# EAGLE schematic 10004_epic_cape (EAGLE 6.3)

## Sheet 1 of 3
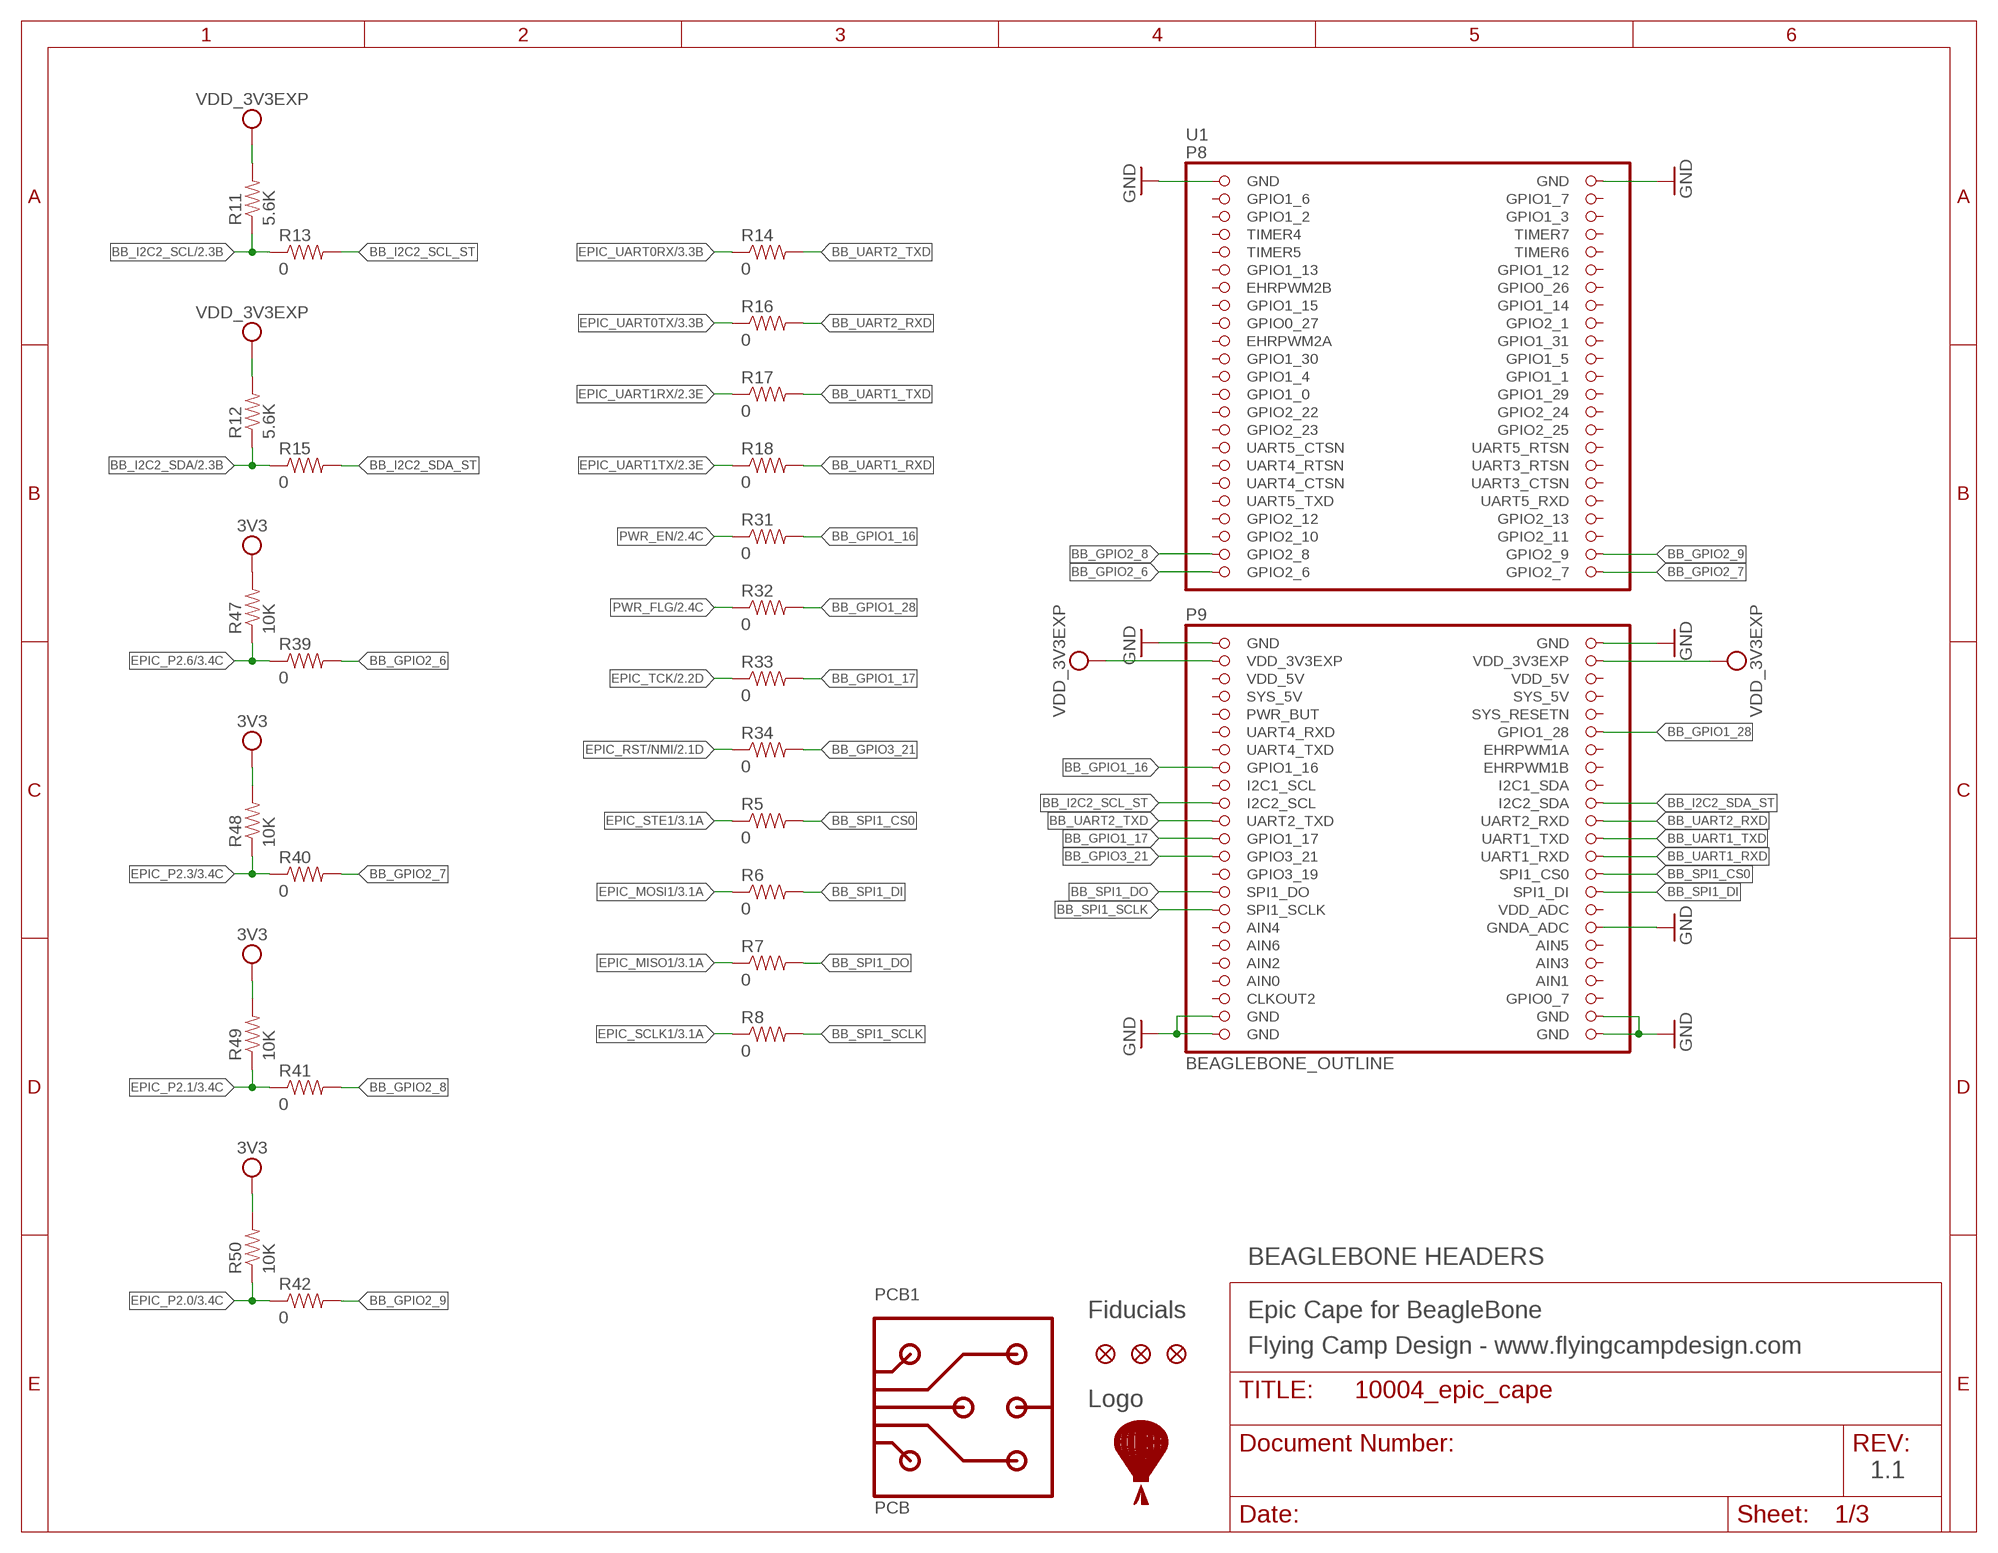
[diagram p0: schematic, sheet 1]
PCB1 (PCB): MFR: Flying Camp Design; MPN: 10004

### Parts
R5  0  RESISTOR1005  [RESC1005]
R6  0  RESISTOR1005  [RESC1005]
R7  0  RESISTOR1005  [RESC1005]
R8  0  RESISTOR1005  [RESC1005]
R11  5.6K  RESISTOR1005  [RESC1005]
R12  5.6K  RESISTOR1005  [RESC1005]
R13  0  RESISTOR1005  [RESC1005]
R14  0  RESISTOR1005  [RESC1005]
R15  0  RESISTOR1005  [RESC1005]
R16  0  RESISTOR1005  [RESC1005]
R17  0  RESISTOR1005  [RESC1005]
R18  0  RESISTOR1005  [RESC1005]
R31  0  RESISTOR1005  [RESC1005]
R32  0  RESISTOR1005  [RESC1005]
R33  0  RESISTOR1005  [RESC1005]
R34  0  RESISTOR1005  [RESC1005]
R39  0  RESISTOR1005  [RESC1005]
R40  0  RESISTOR1005  [RESC1005]
R41  0  RESISTOR1005  [RESC1005]
R42  0  RESISTOR1005  [RESC1005]
R47  10K  RESISTOR1005  [RESC1005]
R48  10K  RESISTOR1005  [RESC1005]
R49  10K  RESISTOR1005  [RESC1005]
R50  10K  RESISTOR1005  [RESC1005]
U1  BEAGLEBONE_OUTLINE  [BEAGLEBONE_SHIELD]
U$2  LOGO  [LOGO]
U$3  FIDUCIAL1X2.5  [FIDUCIAL-1X2.5]
U$4  FIDUCIAL1X2.5  [FIDUCIAL-1X2.5]
U$5  FIDUCIAL1X2.5  [FIDUCIAL-1X2.5]

### Nets
3V3: R47.2 R48.2 R49.2 R50.2 ; also sheet 2,3
BB_GPIO1_16: R31.2 U1.61(GPIO1_16)
BB_GPIO1_17: R33.2 U1.69(GPIO1_17)
BB_GPIO1_28: R32.2 U1.58(GPIO1_28)
BB_GPIO2_6: R39.2 U1.45(GPIO2_6)
BB_GPIO2_7: R40.2 U1.46(GPIO2_7)
BB_GPIO2_8: R41.2 U1.43(GPIO2_8)
BB_GPIO2_9: R42.2 U1.44(GPIO2_9)
BB_GPIO3_21: R34.2 U1.71(GPIO3_21)
BB_I2C2_SCL: R11.1 R13.1 ; also sheet 2
BB_I2C2_SCL_ST: R13.2 U1.65(I2C2_SCL)
BB_I2C2_SDA: R12.1 R15.1 ; also sheet 2
BB_I2C2_SDA_ST: R15.2 U1.66(I2C2_SDA)
BB_SPI1_CS0: R5.2 U1.74(SPI1_CS0)
BB_SPI1_DI: R6.2 U1.76(SPI1_DI)
BB_SPI1_DO: R7.2 U1.75(SPI1_DO)
BB_SPI1_SCLK: R8.2 U1.77(SPI1_SCLK)
BB_UART1_RXD: R18.2 U1.72(UART1_RXD)
BB_UART1_TXD: R17.2 U1.70(UART1_TXD)
BB_UART2_RXD: R16.2 U1.68(UART2_RXD)
BB_UART2_TXD: R14.2 U1.67(UART2_TXD)
EPIC_MISO1: R7.1 ; also sheet 3
EPIC_MOSI1: R6.1 ; also sheet 3
EPIC_P2.0: R42.1 R50.1 ; also sheet 3
EPIC_P2.1: R41.1 R49.1 ; also sheet 3
EPIC_P2.3: R40.1 R48.1 ; also sheet 3
EPIC_P2.6: R39.1 R47.1 ; also sheet 3
EPIC_RST/NMI: R34.1 ; also sheet 2,3
EPIC_SCLK1: R8.1 ; also sheet 3
EPIC_STE1: R5.1 ; also sheet 3
EPIC_TCK: R33.1 ; also sheet 2,3
EPIC_UART0RX: R14.1 ; also sheet 3
EPIC_UART0TX: R16.1 ; also sheet 3
EPIC_UART1RX: R17.1 ; also sheet 2,3
EPIC_UART1TX: R18.1 ; also sheet 2,3
GND: U1.1(GND) U1.2(GND) U1.47(GND) U1.48(GND) U1.80(GNDA_ADC) U1.89(GND) U1.90(GND) U1.91(GND) U1.92(GND) ; also sheet 2,3
PWR_EN: R31.1 ; also sheet 2
PWR_FLG: R32.1 ; also sheet 2
VDD_3V3EXP: R11.2 R12.2 U1.49(VDD_3V3EXP) U1.50(VDD_3V3EXP) ; also sheet 2
Unconnected: U1.5(GPIO1_2) U1.6(GPIO1_3) U1.7(TIMER4) U1.8(TIMER7) U1.9(TIMER5) U1.10(TIMER6) U1.11(GPIO1_13) U1.12(GPIO1_12) U1.13(EHRPWM2B) U1.14(GPIO0_26) U1.15(GPIO1_15) U1.16(GPIO1_14) U1.17(GPIO0_27) U1.18(GPIO2_1) U1.19(EHRPWM2A) U1.20(GPIO1_31) U1.21(GPIO1_30) U1.22(GPIO1_5) U1.23(GPIO1_4) U1.24(GPIO1_1) U1.25(GPIO1_0) U1.26(GPIO1_29) U1.27(GPIO2_22) U1.28(GPIO2_24) U1.29(GPIO2_23) U1.30(GPIO2_25) U1.31(UART5_CTSN) U1.32(UART5_RTSN) U1.33(UART4_RTSN) U1.34(UART3_RTSN) U1.35(UART4_CTSN) U1.36(UART3_CTSN) U1.37(UART5_TXD) U1.38(UART5_RXD) U1.39(GPIO2_12) U1.40(GPIO2_13) U1.41(GPIO2_10) U1.53(SYS_5V) U1.54(SYS_5V) U1.55(PWR_BUT) U1.56(SYS_RESETN) U1.57(UART4_RXD) U1.59(UART4_TXD) U1.60(EHRPWM1A) U1.62(EHRPWM1B) U1.63(I2C1_SCL) U1.64(I2C1_SDA) U1.73(GPIO3_19) U1.78(VDD_ADC) U1.79(AIN4) U1.81(AIN6) U1.82(AIN5) U1.83(AIN2) U1.86(AIN1) U1.87(CLKOUT2) U1.88(GPIO0_7)

### Notes on the sheet
- BEAGLEBONE HEADERS
- Fiducials | Epic Cape for BeagleBone
- Flying Camp Design - www.flyingcampdesign.com
- Logo
- 1.1

## Sheet 2 of 3
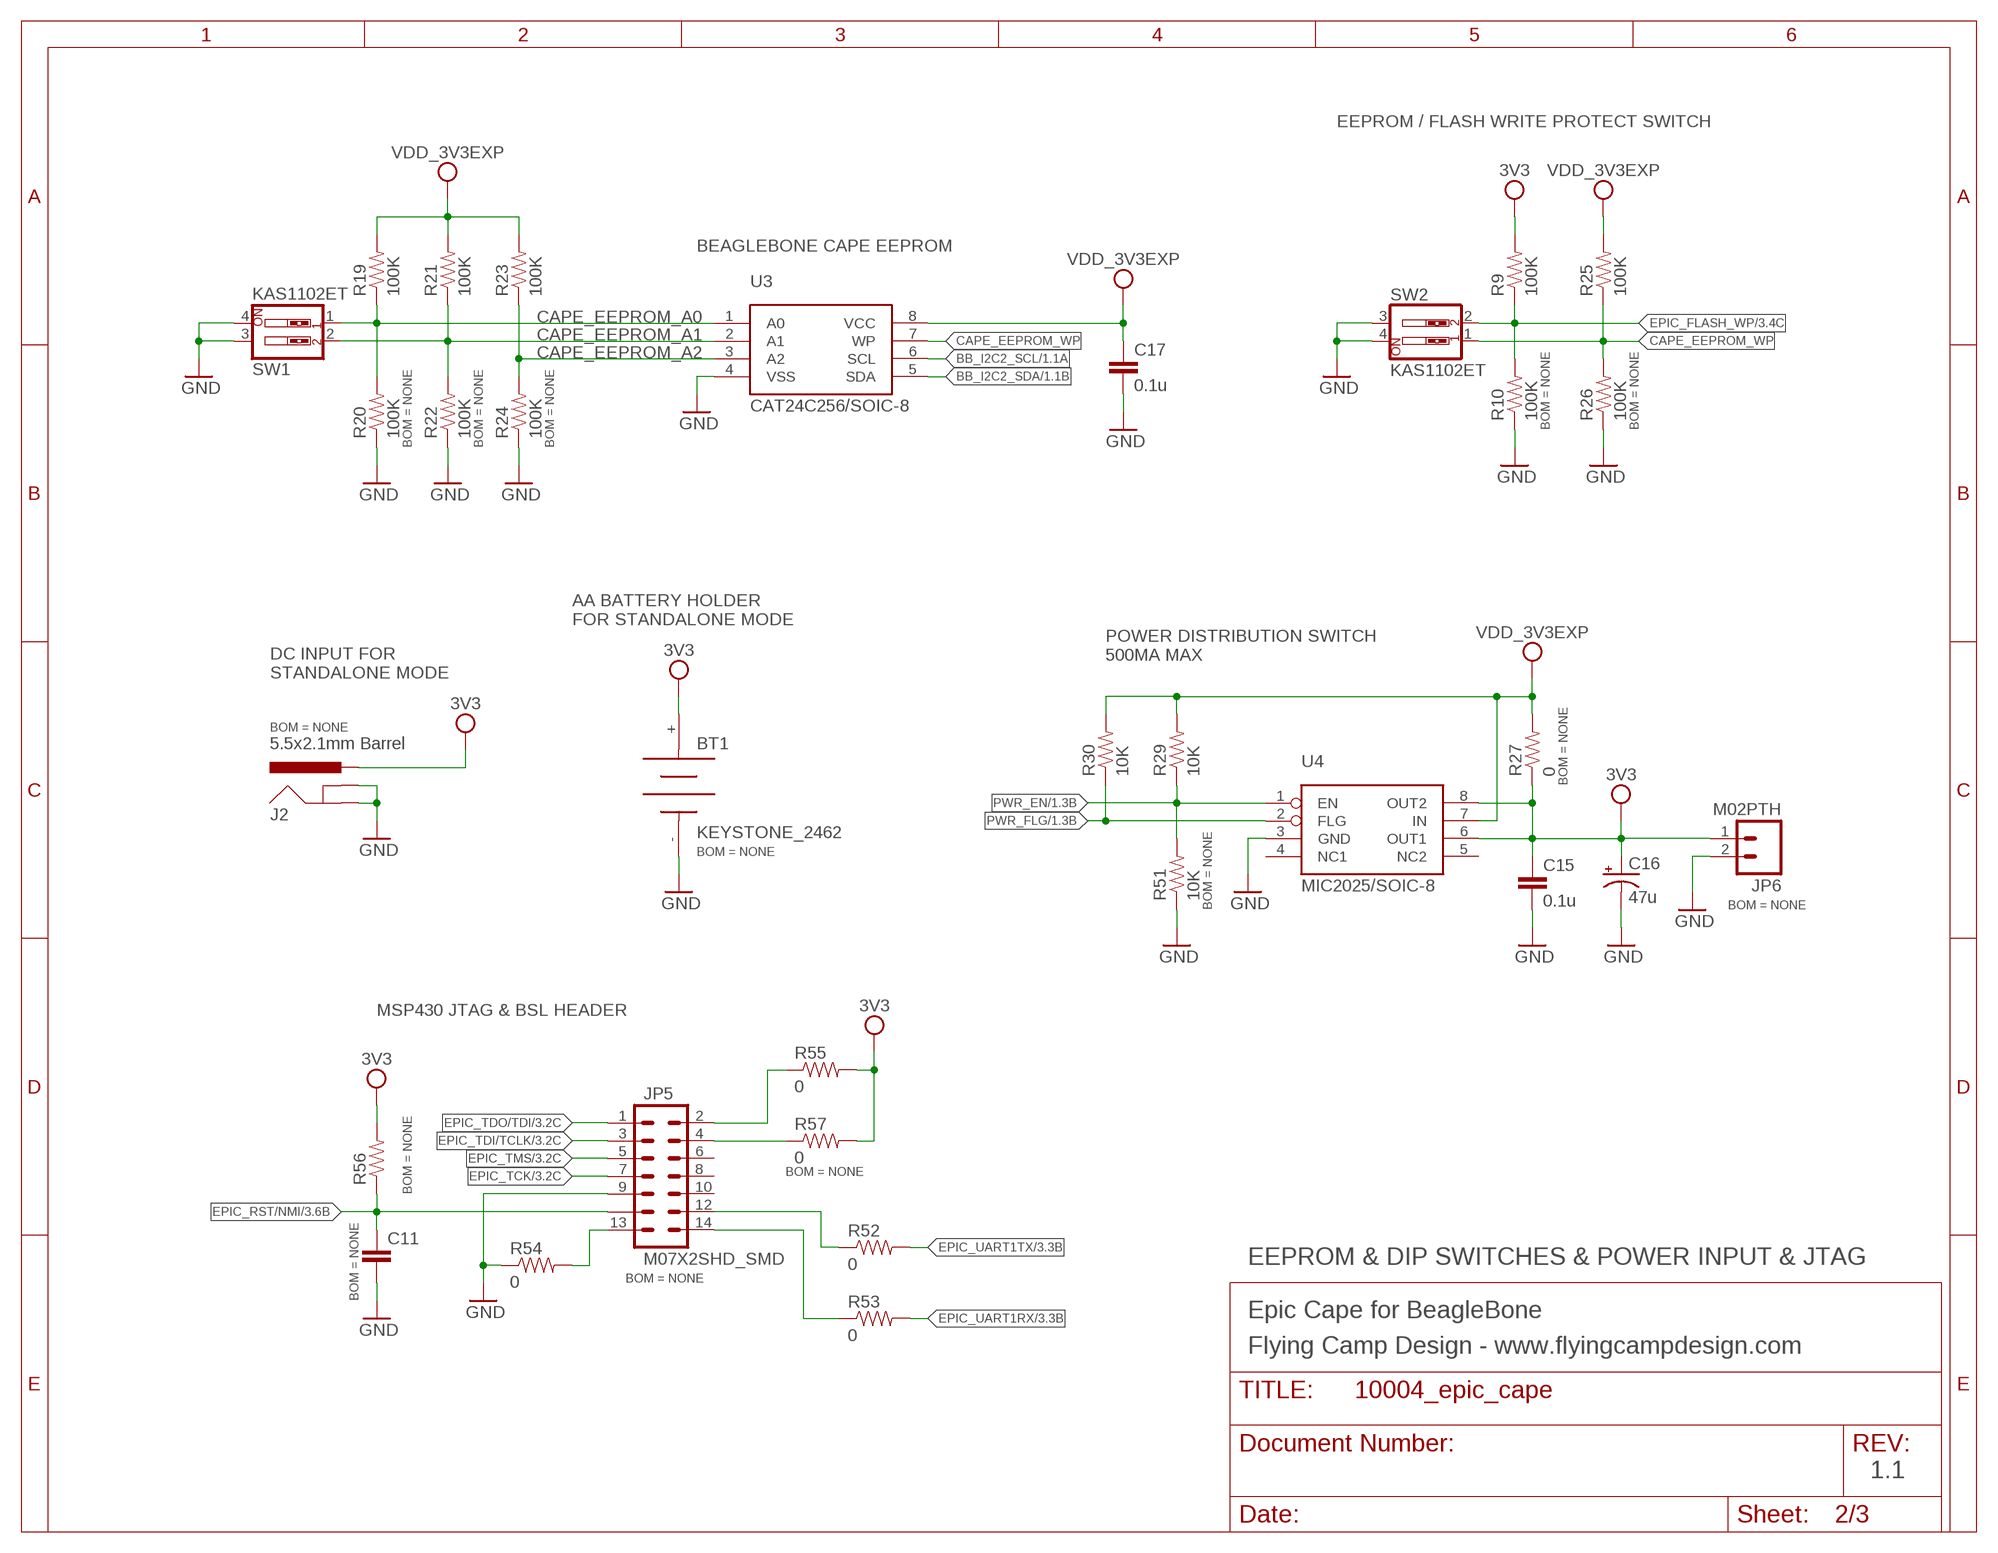
[diagram p1: schematic, sheet 2]

### Parts
BT1  KEYSTONE_2462  [KEYSTONE_2462]
C11  CAPACITOR1005  [CAPC1005]
C15  0.1u  CAPACITOR1005  [CAPC1005]
C16  47u  CAP_POL/1206  [EIA3216]
C17  0.1u  CAPACITOR1005  [CAPC1005]
J2  5.5x2.1mm Barrel  POWER_JACKSMD  [POWER_JACK_SMD]
JP5  M07X2SHD_SMD  [2X7-SHROUDED_SMD]
JP6  M02PTH  [1X02]
R9  100K  RESISTOR1005  [RESC1005]
R10  100K  RESISTOR1005  [RESC1005]
R19  100K  RESISTOR1005  [RESC1005]
R20  100K  RESISTOR1005  [RESC1005]
R21  100K  RESISTOR1005  [RESC1005]
R22  100K  RESISTOR1005  [RESC1005]
R23  100K  RESISTOR1005  [RESC1005]
R24  100K  RESISTOR1005  [RESC1005]
R25  100K  RESISTOR1005  [RESC1005]
R26  100K  RESISTOR1005  [RESC1005]
R27  0  RESISTOR3216  [RESC3216]
R29  10K  RESISTOR1005  [RESC1005]
R30  10K  RESISTOR1005  [RESC1005]
R51  10K  RESISTOR1005  [RESC1005]
R52  0  RESISTOR1005  [RESC1005]
R53  0  RESISTOR1005  [RESC1005]
R54  0  RESISTOR1005  [RESC1005]
R55  0  RESISTOR1005  [RESC1005]
R56  RESISTOR1005  [RESC1005]
R57  0  RESISTOR1005  [RESC1005]
SW1  KAS1102ET  SW_DIP-2  [DIPSWITCH-02]
SW2  KAS1102ET  SW_DIP-2  [DIPSWITCH-02]
U3  CAT24C256/SOIC-8  [SOIC-8]
U4  MIC2025/SOIC-8  [SOIC-8]

### Nets
3V3: BT1.+ C15.1 C16.A(+) J2.VIN0(PWR) JP6.1 R9.2 R27.1 R55.2 R56.2 R57.2 U4.6(OUT1) U4.8(OUT2) ; also sheet 1,3
BB_I2C2_SCL: U3.6(SCL) ; also sheet 1
BB_I2C2_SDA: U3.5(SDA) ; also sheet 1
CAPE_EEPROM_A0: R19.1 R20.2 SW1.1 U3.1(A0)
CAPE_EEPROM_A1: R21.1 R22.2 SW1.2 U3.2(A1)
CAPE_EEPROM_A2: R23.1 R24.2 U3.3(A2)
CAPE_EEPROM_WP: R25.1 R26.2 SW2.1 U3.7(WP)
EPIC_FLASH_WP: R9.1 R10.2 SW2.2 ; also sheet 3
EPIC_RST/NMI: C11.1 JP5.11 R56.1 ; also sheet 1,3
EPIC_TCK: JP5.7 ; also sheet 1,3
EPIC_TDI/TCLK: JP5.3 ; also sheet 3
EPIC_TDO/TDI: JP5.1 ; also sheet 3
EPIC_TMS: JP5.5 ; also sheet 3
EPIC_UART1RX: R53.2 ; also sheet 1,3
EPIC_UART1TX: R52.2 ; also sheet 1,3
GND: BT1.- C11.2 C15.2 C16.C(-) C17.2 J2.GND(GNDBREAK) J2.P$4(GND) JP5.9 JP6.2 R10.1 R20.1 R22.1 R24.1 R26.1 R51.1 R54.1 SW1.3 SW1.4 SW2.3 SW2.4 U3.4(VSS) U4.3(GND) ; also sheet 1,3
N$3: JP5.13 R54.2
N$18: JP5.12 R52.1
N$20: JP5.14 R53.1
PWR_EN: R29.1 R51.2 U4.1(EN) ; also sheet 1
PWR_FLG: R30.1 U4.2(FLG) ; also sheet 1
VCCTARGET: JP5.4 R57.1
VCCTOOL: JP5.2 R55.1
VDD_3V3EXP: C17.1 R19.2 R21.2 R23.2 R25.2 R27.2 R29.2 R30.2 U3.8(VCC) U4.7(IN) ; also sheet 1
Unconnected: JP5.6 JP5.8 JP5.10 U4.4(NC1) U4.5(NC2)

### Notes on the sheet
- EEPROM / FLASH WRITE PROTECT SWITCH
- BEAGLEBONE CAPE EEPROM
- AA BATTERY HOLDER
  FOR STANDALONE MODE
- POWER DISTRIBUTION SWITCH
  500MA MAX
- DC INPUT FOR
  STANDALONE MODE
- MSP430 JTAG & BSL HEADER
- EEPROM & DIP SWITCHES & POWER INPUT & JTAG
- Epic Cape for BeagleBone
- Flying Camp Design - www.flyingcampdesign.com
- 1.1

## Sheet 3 of 3
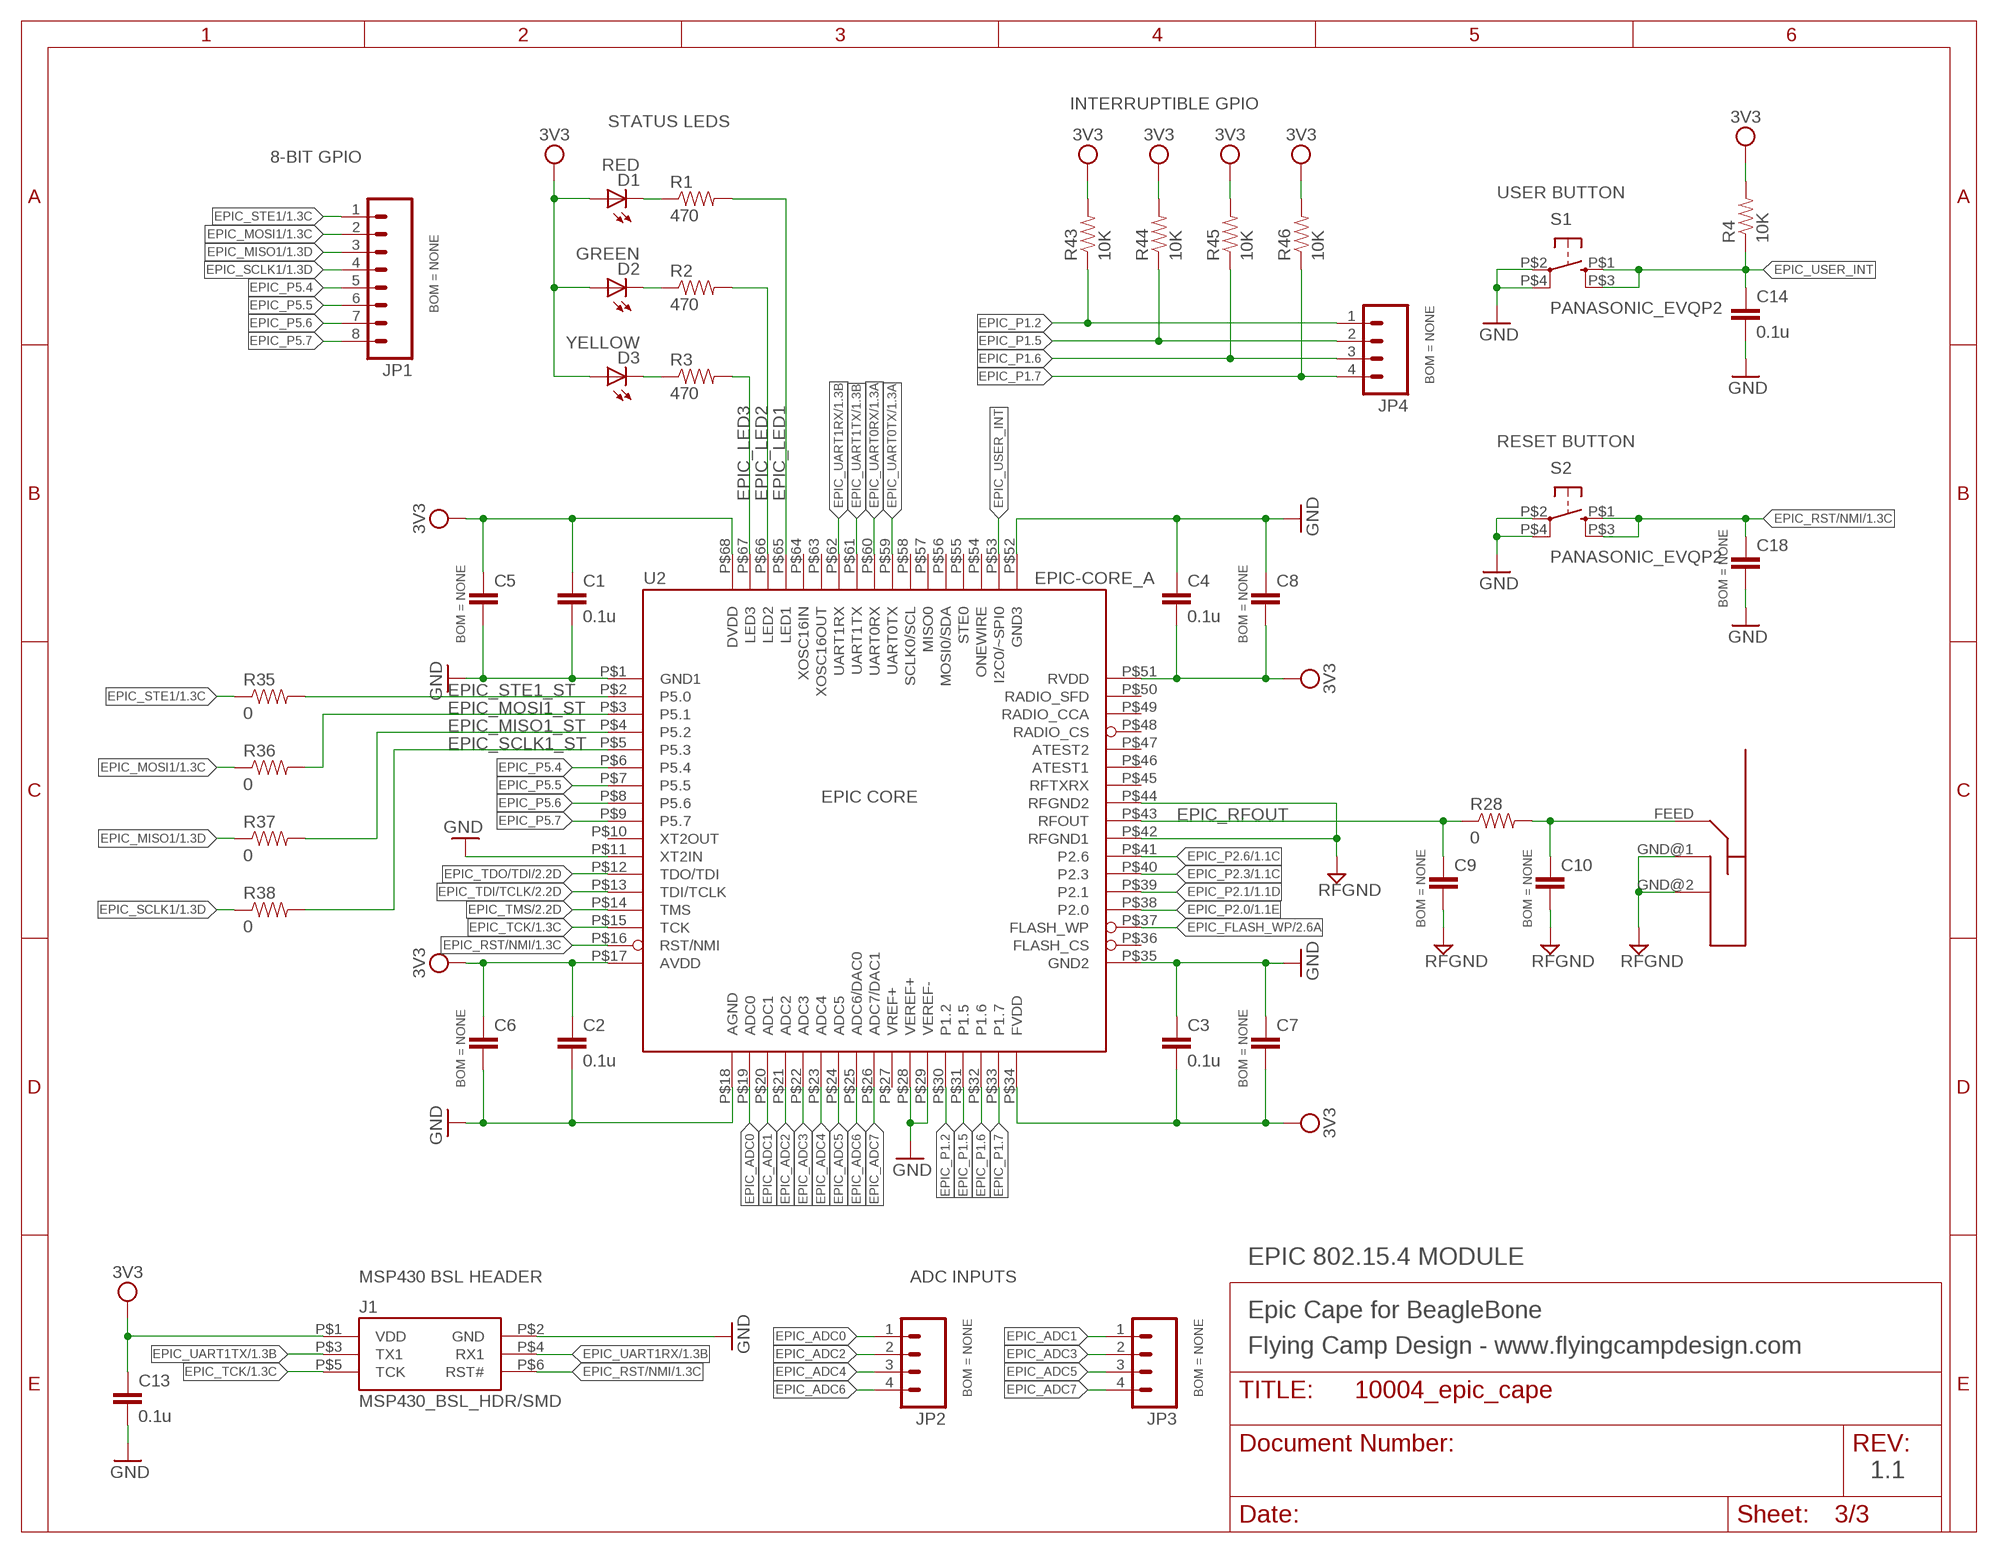
[diagram p2: schematic, sheet 3]

### Parts
ANT1  2.4GHZ_INVERTED_F_ANTENNA  [2.4GHZ_INVERTED_F_ANTENNA]
C1  0.1u  CAPACITOR1005  [CAPC1005]
C2  0.1u  CAPACITOR1005  [CAPC1005]
C3  0.1u  CAPACITOR1005  [CAPC1005]
C4  0.1u  CAPACITOR1005  [CAPC1005]
C5  CAPACITOR2012  [CAPC2012]
C6  CAPACITOR2012  [CAPC2012]
C7  CAPACITOR2012  [CAPC2012]
C8  CAPACITOR2012  [CAPC2012]
C9  CAPACITOR1005  [CAPC1005]
C10  CAPACITOR1005  [CAPC1005]
C13  0.1u  CAPACITOR1005  [CAPC1005]
C14  0.1u  CAPACITOR1005  [CAPC1005]
C18  CAPACITOR1005  [CAPC1005]
D1  RED  LED1608  [LEDC1608]
D2  GREEN  LED1608  [LEDC1608]
D3  YELLOW  LED1608  [LEDC1608]
J1  MSP430_BSL_HDR/SMD  [HIROSE_DF11G-XXDP-2V]
JP1  M081X08  [1X08]
JP2  M04PTH  [1X04]
JP3  M04PTH  [1X04]
JP4  M04PTH  [1X04]
R1  470  RESISTOR1005  [RESC1005]
R2  470  RESISTOR1005  [RESC1005]
R3  470  RESISTOR1005  [RESC1005]
R4  10K  RESISTOR1005  [RESC1005]
R28  0  RESISTOR1005  [RESC1005]
R35  0  RESISTOR1005  [RESC1005]
R36  0  RESISTOR1005  [RESC1005]
R37  0  RESISTOR1005  [RESC1005]
R38  0  RESISTOR1005  [RESC1005]
R43  10K  RESISTOR1005  [RESC1005]
R44  10K  RESISTOR1005  [RESC1005]
R45  10K  RESISTOR1005  [RESC1005]
R46  10K  RESISTOR1005  [RESC1005]
S1  PANASONIC_EVQP2  [PANASONIC_EVQP2]
S2  PANASONIC_EVQP2  [PANASONIC_EVQP2]
U2  EPIC-CORE_A  [EPIC_LCC68]

### Nets
3V3: C1.1 C2.1 C3.2 C4.2 C5.1 C6.1 C7.2 C8.2 C13.1 D1.A D2.A D3.A J1.P$1(VDD) R4.2 R43.2 R44.2 R45.2 R46.2 U2.P$17(AVDD) U2.P$34(FVDD) U2.P$51(RVDD) U2.P$68(DVDD) ; also sheet 1,2
EPIC_ADC0: JP2.1 U2.P$19(ADC0)
EPIC_ADC1: JP3.1 U2.P$20(ADC1)
EPIC_ADC2: JP2.2 U2.P$21(ADC2)
EPIC_ADC3: JP3.2 U2.P$22(ADC3)
EPIC_ADC4: JP2.3 U2.P$23(ADC4)
EPIC_ADC5: JP3.3 U2.P$24(ADC5)
EPIC_ADC6: JP2.4 U2.P$25(ADC6/DAC0)
EPIC_ADC7: JP3.4 U2.P$26(ADC7/DAC1)
EPIC_FLASH_WP: U2.P$37(FLASH_WP) ; also sheet 2
EPIC_LED1: R1.2 U2.P$65(LED1)
EPIC_LED2: R2.2 U2.P$66(LED2)
EPIC_LED3: R3.2 U2.P$67(LED3)
EPIC_MISO1: JP1.3 R37.1 ; also sheet 1
EPIC_MISO1_ST: R37.2 U2.P$4(P5.2)
EPIC_MOSI1: JP1.2 R36.1 ; also sheet 1
EPIC_MOSI1_ST: R36.2 U2.P$3(P5.1)
EPIC_P1.2: JP4.1 R43.1 U2.P$30(P1.2)
EPIC_P1.5: JP4.2 R44.1 U2.P$31(P1.5)
EPIC_P1.6: JP4.3 R45.1 U2.P$32(P1.6)
EPIC_P1.7: JP4.4 R46.1 U2.P$33(P1.7)
EPIC_P2.0: U2.P$38(P2.0) ; also sheet 1
EPIC_P2.1: U2.P$39(P2.1) ; also sheet 1
EPIC_P2.3: U2.P$40(P2.3) ; also sheet 1
EPIC_P2.6: U2.P$41(P2.6) ; also sheet 1
EPIC_P5.4: JP1.5 U2.P$6(P5.4)
EPIC_P5.5: JP1.6 U2.P$7(P5.5)
EPIC_P5.6: JP1.7 U2.P$8(P5.6)
EPIC_P5.7: JP1.8 U2.P$9(P5.7)
EPIC_RFOUT [rfout]: C9.1 R28.1 U2.P$43(RFOUT)
EPIC_RST/NMI: C18.1 J1.P$6(RST#) S2.P$1 S2.P$3 U2.P$16(RST/NMI) ; also sheet 1,2
EPIC_SCLK1: JP1.4 R38.1 ; also sheet 1
EPIC_SCLK1_ST: R38.2 U2.P$5(P5.3)
EPIC_STE1: JP1.1 R35.1 ; also sheet 1
EPIC_STE1_ST: R35.2 U2.P$2(P5.0)
EPIC_TCK: J1.P$5(TCK) U2.P$15(TCK) ; also sheet 1,2
EPIC_TDI/TCLK: U2.P$13(TDI/TCLK) ; also sheet 2
EPIC_TDO/TDI: U2.P$12(TDO/TDI) ; also sheet 2
EPIC_TMS: U2.P$14(TMS) ; also sheet 2
EPIC_UART0RX: U2.P$60(UART0RX) ; also sheet 1
EPIC_UART0TX: U2.P$59(UART0TX) ; also sheet 1
EPIC_UART1RX: J1.P$4(RX1) U2.P$62(UART1RX) ; also sheet 1,2
EPIC_UART1TX: J1.P$3(TX1) U2.P$61(UART1TX) ; also sheet 1,2
EPIC_USER_INT: C14.1 R4.1 S1.P$1 S1.P$3 U2.P$53(I2C0/~SPI0)
FEED [rfout]: ANT1.FEED C10.1 R28.2
GND: C1.2 C2.2 C3.1 C4.1 C5.2 C6.2 C7.1 C8.1 C13.2 C14.2 C18.2 J1.P$2(GND) S1.P$2 S1.P$4 S2.P$2 S2.P$4 U2.P$1(GND1) U2.P$11(XT2IN) U2.P$18(AGND) U2.P$28(VEREF+) U2.P$29(VEREF-) U2.P$35(GND2) U2.P$52(GND3) ; also sheet 1,2
N$9: D1.C R1.1
N$10: D2.C R2.1
N$11: D3.C R3.1
RFGND: ANT1.GND@1(GND) ANT1.GND@2(GND) C9.2 C10.2 U2.P$42(RFGND1) U2.P$44(RFGND2)
Unconnected: U2.P$10(XT2OUT) U2.P$27(VREF+) U2.P$36(FLASH_CS) U2.P$45(RFTXRX) U2.P$46(ATEST1) U2.P$47(ATEST2) U2.P$48(RADIO_CS) U2.P$49(RADIO_CCA) U2.P$50(RADIO_SFD) U2.P$54(ONEWIRE) U2.P$55(STE0) U2.P$56(MOSI0/SDA) U2.P$57(MISO0) U2.P$58(SCLK0/SCL) U2.P$63(XOSC16OUT) U2.P$64(XOSC16IN)

### Notes on the sheet
- INTERRUPTIBLE GPIO
- STATUS LEDS
- 8-BIT GPIO
- USER BUTTON
- RESET BUTTON
- EPIC CORE
- EPIC 802.15.4 MODULE
- MSP430 BSL HEADER | ADC INPUTS
- Epic Cape for BeagleBone
- Flying Camp Design - www.flyingcampdesign.com
- 1.1

## Power pins joined to a net without a drawn wire
AIN0: U1.85(AIN0)
AIN3: U1.84(AIN3)
GPIO1_6: U1.3(GPIO1_6)
GPIO1_7: U1.4(GPIO1_7)
GPIO2_11: U1.42(GPIO2_11)
VDD_5V: U1.51(VDD_5V) U1.52(VDD_5V)

## Library data of the parts
ANT1 = fcd:2.4GHZ_INVERTED_F_ANTENNA: 2.4 GHz Inverted F Antenna See swru120 <www.ti.com/lit/pdf/swru120> for more details. Extracted from Inverted_F_Antenna.spl Gerber file found in swrr034 <www.ti.com/lit/zip/swrr034>.; BOM: NONE
BT1 = fcd:KEYSTONE_2462: 2 cell AA battery holder; BOM: NONE; COST: 0.59675; MFR: Keystone; MPN: 2462
C1-C4 C13-C15 C17 = fcd:CAPACITOR: Capacitor; COST: 0.01350; MFR: Kemet; MPN: C0402C104K9RACTU
C5-C11 C18 = fcd:CAPACITOR: Capacitor; BOM: NONE
C16 = fcd:CAP_POL: Capacitor Polarized These are standard SMD and PTH capacitors. Normally 10uF, 47uF, and 100uF in electrolytic and tantalum varieties. Always verify the external diameter of the through hole cap, it varies with capacity, voltage, and manufacturer. The EIA devices should be standard.; COST: 0.23513; MFR: Kemet; MPN: T491A476M006AT
D1 = fcd:LED: LED; COST: 0.07500; MFR: Everlight; MPN: QTLP600C7TR
D2 = fcd:LED: LED; COST: 0.09250; MFR: Everlight; MPN: QTLP601C4TR
D3 = fcd:LED: LED; COST: 0.07600; MFR: Everlight; MPN: QTLP600CYTR
J1 = fcd:MSP430_BSL_HDR: MSP430 BSL Programming Header Mating header for the Flying Camp Design MSP430 BSL Programmer <http://www.flyingcampdesign.com/msp430-bsl-programmer.html>.; COST: 0.74704; MFR: Hirose; MPN: DF11G-6DP-2V(50)
J2 = SparkFun-Connectors:POWER_JACK: Power Jack This is the standard 5.5mm barrel jack for power. The PTH is the most common, proven, reliable, footprint. The Slot footprint only works if the mill layer is transmitted to the PCB fab house so be warned. Spark Fun Electronics SKU : PRT-00119 SMT: CONN-08106 Mating wall wart : TOL-00298 (and others); BOM: NONE; COST: 1.12100; MFR: CUI; MPN: PJ-002AH-SMT-TR; PROD_ID: CONN-08106
JP1 = fcd:M08: Header 8; BOM: NONE
JP2-JP4 = fcd:M04: Header 4; BOM: NONE
JP5 = fcd:M07X2: Header 7x2; BOM: NONE
JP6 = fcd:M02: HEADER 2; BOM: NONE
R1-R3 = fcd:RESISTOR: Resistor; COST: 0.00672; MFR: Panasonic; MPN: ERJ-2RKF4700X
R4 R29 R30 R43-R50 = fcd:RESISTOR: Resistor; COST: 0.00672; MFR: Panasonic; MPN: ERJ-2RKF1002X
R5-R8 R13-R18 R28 R31-R42 R52-R55 = fcd:RESISTOR: Resistor; COST: 0.00480; MFR: Panasonic; MPN: ERJ-2GE0R00X
R9 R19 R21 R23 R25 = fcd:RESISTOR: Resistor; COST: 0.00672; MFR: Panasonic; MPN: ERJ-2RKF1003X
R10 R20 R22 R24 R26 = fcd:RESISTOR: Resistor; BOM: NONE; COST: 0.00672; MFR: Panasonic; MPN: ERJ-2RKF1003X
R11 R12 = fcd:RESISTOR: Resistor; COST: 0.00672; MFR: Panasonic; MPN: ERJ-2RKF5601X
R27 = fcd:RESISTOR: Resistor; BOM: NONE; COST: 0.00672; MFR: Panasonic; MPN: ERJ-8GEY0R00V
R51 = fcd:RESISTOR: Resistor; BOM: NONE; COST: 0.00672; MFR: Panasonic; MPN: ERJ-2RKF1002X
R56 = fcd:RESISTOR: Resistor; BOM: NONE
R57 = fcd:RESISTOR: Resistor; BOM: NONE; COST: 0.00480; MFR: Panasonic; MPN: ERJ-2GE0R00X
S1 S2 = fcd:PANASONIC_EVQP2: SMD Light Touch Switch; COST: 0.45619; MFR: Panasonic; MPN: EVQ-P2K02Q
SW1 SW2 = fcd:SW_DIP-2: Dip Switch; COST: 0.77000; MFR: E-Switch; MPN: KAS1102ET
U1 = fcd:BEAGLEBONE_OUTLINE: BeagleBone Cape Outline Should match A3 pinout - but not completely tested; BOM: NONE
U2 = fcd:EPIC-CORE_A: Epic Core Epic: An Open Mote Platform for Application-Driven Design See http://www.cs.berkeley.edu/~prabal/projects/epic/ for Open Source hardware design files.; COST: 49.00; MFR: Moteware; MPN: EPIC-CORE-PCB
U3 = fcd:CAT24C: EEPROM 256KBit 400KHz; COST: 0.28463; MFR: ON Semiconductor; MPN: CAT24C256WI-GT3
U4 = fcd:MIC2025: Single-Channel Power Distribution Switch; COST: 0.60200; MFR: Micrel; MPN: MIC2025-1YM
U$2 = fcd:LOGO: Flying Camp Design Logo; BOM: NONE
U$3-U$5 = SparkFun:FIDUCIAL: Fiducial Alignment Points Various fiducial points for machine vision alignment.; BOM: NONE

## Net classes
0 default: width 0.203 mm
1 rfout: width 0.457 mm